# EAGLE schematic converter (EAGLE 7.3.2)
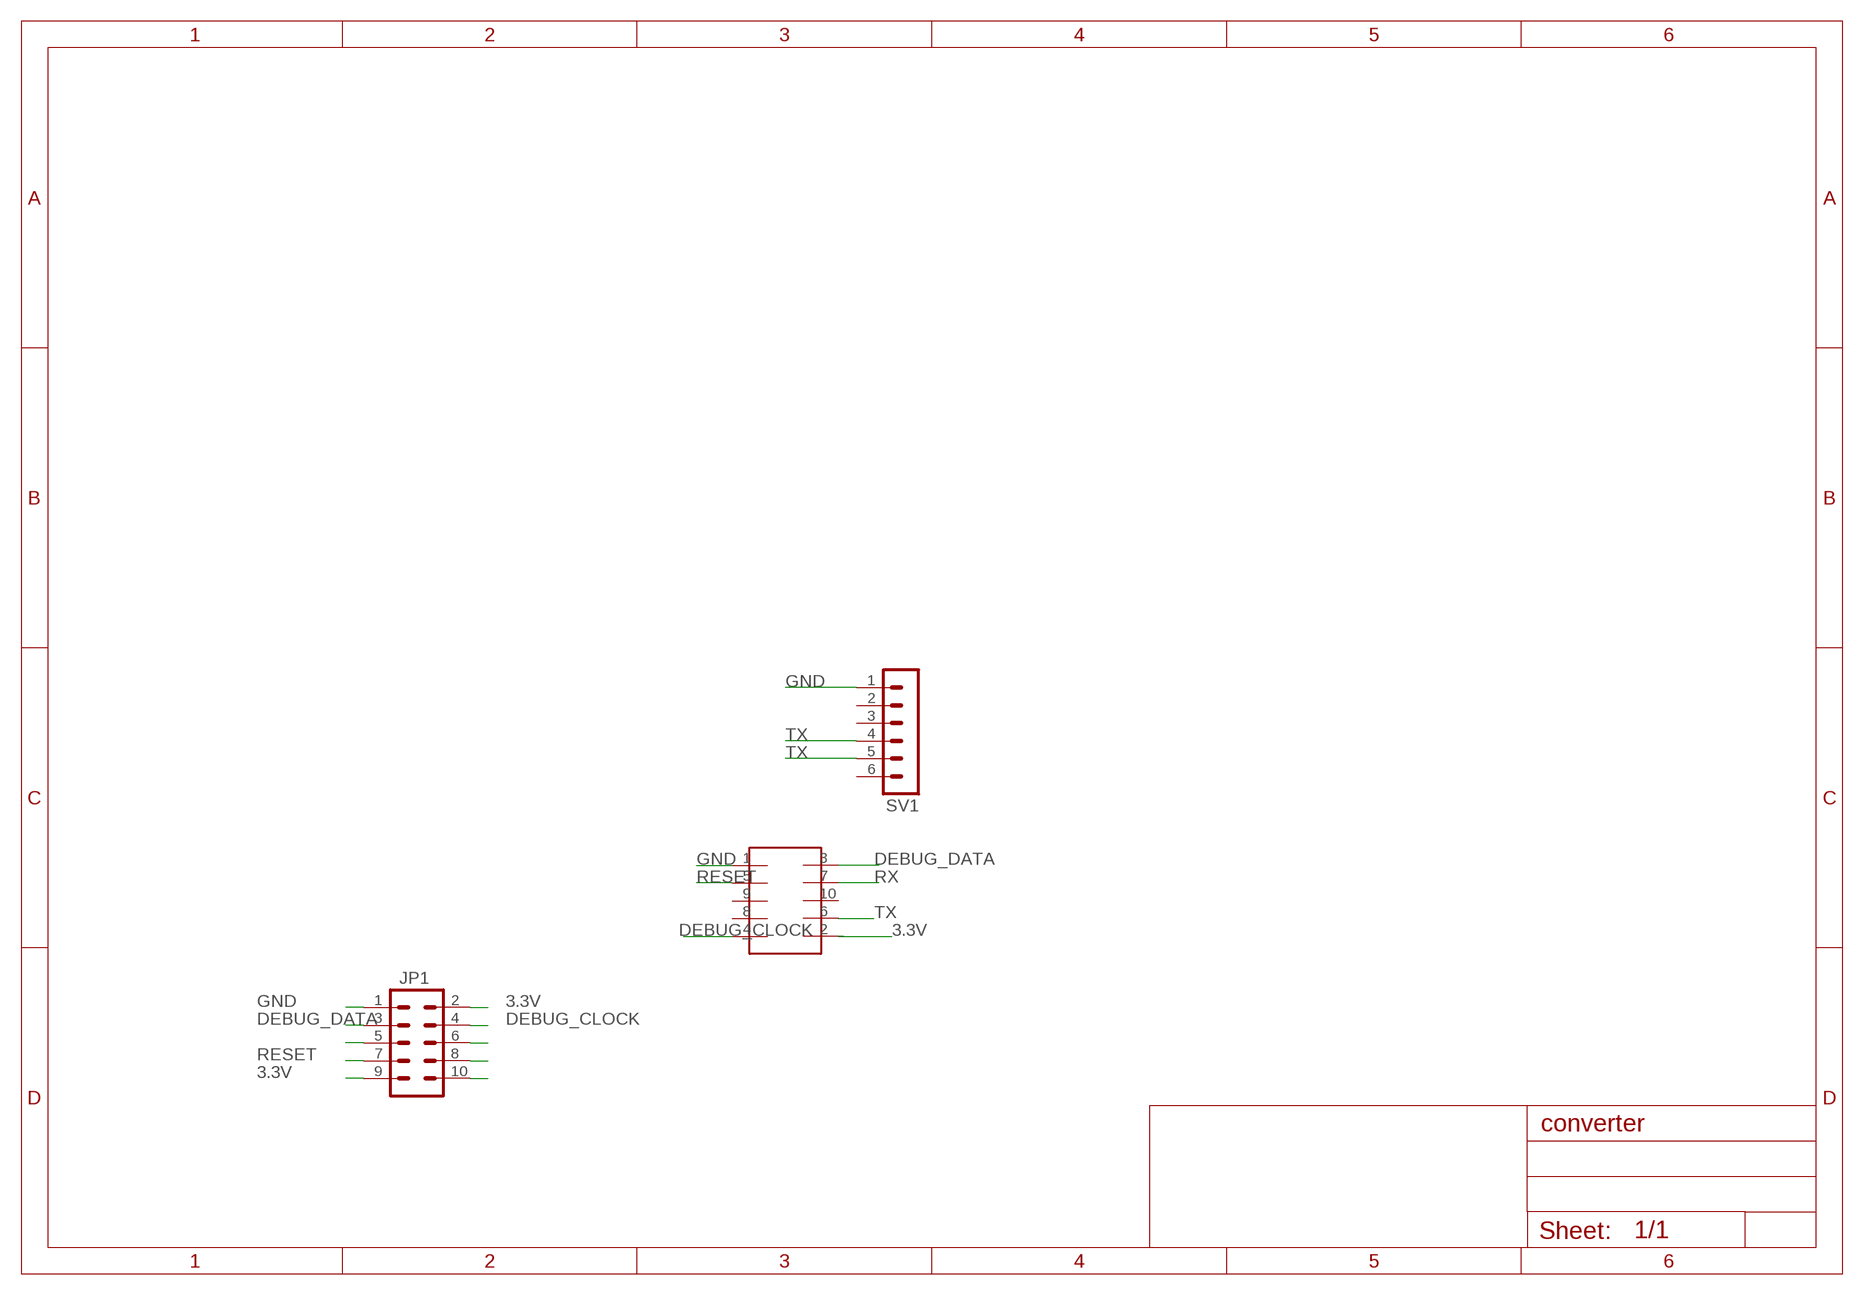
[diagram p0: schematic, sheet 1]

## Parts
JP1  M05X2SHD  [2X5-SHROUDED]
SV1  MA06-1  [MA06-1]
U$4  TC-2050-SOCKET  [TC-2050-SOCKET]

## Nets
3.3V: JP1.2 JP1.9 U$4.2
CSN: JP1.5
DEBUG_CLOCK: JP1.4 U$4.4
DEBUG_DATA: JP1.3 U$4.3
GND: JP1.1 SV1.1 U$4.1
MISO: JP1.10
MOSI: JP1.8
RESET: JP1.7 U$4.5
RX: U$4.7
SCLK: JP1.6
TX: SV1.4 SV1.5 U$4.6
Unconnected: SV1.2 SV1.3 SV1.6 U$4.8 U$4.9 U$4.10

## Library data of the parts
JP1 = SparkFun-Connectors:M05X2: Header 5x2 Standard 10-pin dual row 0.1" header. Commonly used with AVR-ISP. Use with Spark Fun Electronics SKU: PRT-00778
SV1 = con-lstb:MA06-1: PIN HEADER; OC_FARNELL: unknown; OC_NEWARK: unknown
U$4 = GClue-Debbuger:TC-2050-SOCKET